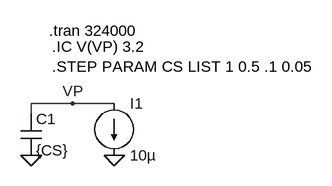
[diagram p0: schematic RTCbu.asc]
RTCbu.asc, the LTspice schematic file:
Version 4
SHEET 1 880 680
WIRE 224 144 160 144
WIRE 288 144 224 144
WIRE 160 160 160 144
FLAG 160 224 0
FLAG 288 224 0
FLAG 224 144 VP
SYMBOL cap 144 160 R0
SYMATTR InstName C1
SYMATTR Value {CS}
SYMBOL current 288 144 R0
WINDOW 123 0 0 Left 2
WINDOW 39 0 0 Left 2
SYMATTR InstName I1
SYMATTR Value 10µ
TEXT 192 56 Left 2 !.IC V(VP) 3.2\n.STEP PARAM CS LIST 1 0.5 .1 0.05
TEXT 188 32 Left 2 !.tran 324000

The netlist it stands for:
* RTCbu.asc
C1 VP 0 {CS}
I1 VP 0 10µ
.IC V(VP) 3.2
.STEP PARAM CS LIST 1 0.5 .1 0.05
.tran 324000
.backanno
.end